# EasyEDA schematic SCH_nfcbusinesscard2_2025-07-16.json
TITLE: Sheet_1; REV: 1.0; Date: 2025-07-11; Sheet: 1/1; Drawn By: jaydenaleung; Company: Your Company
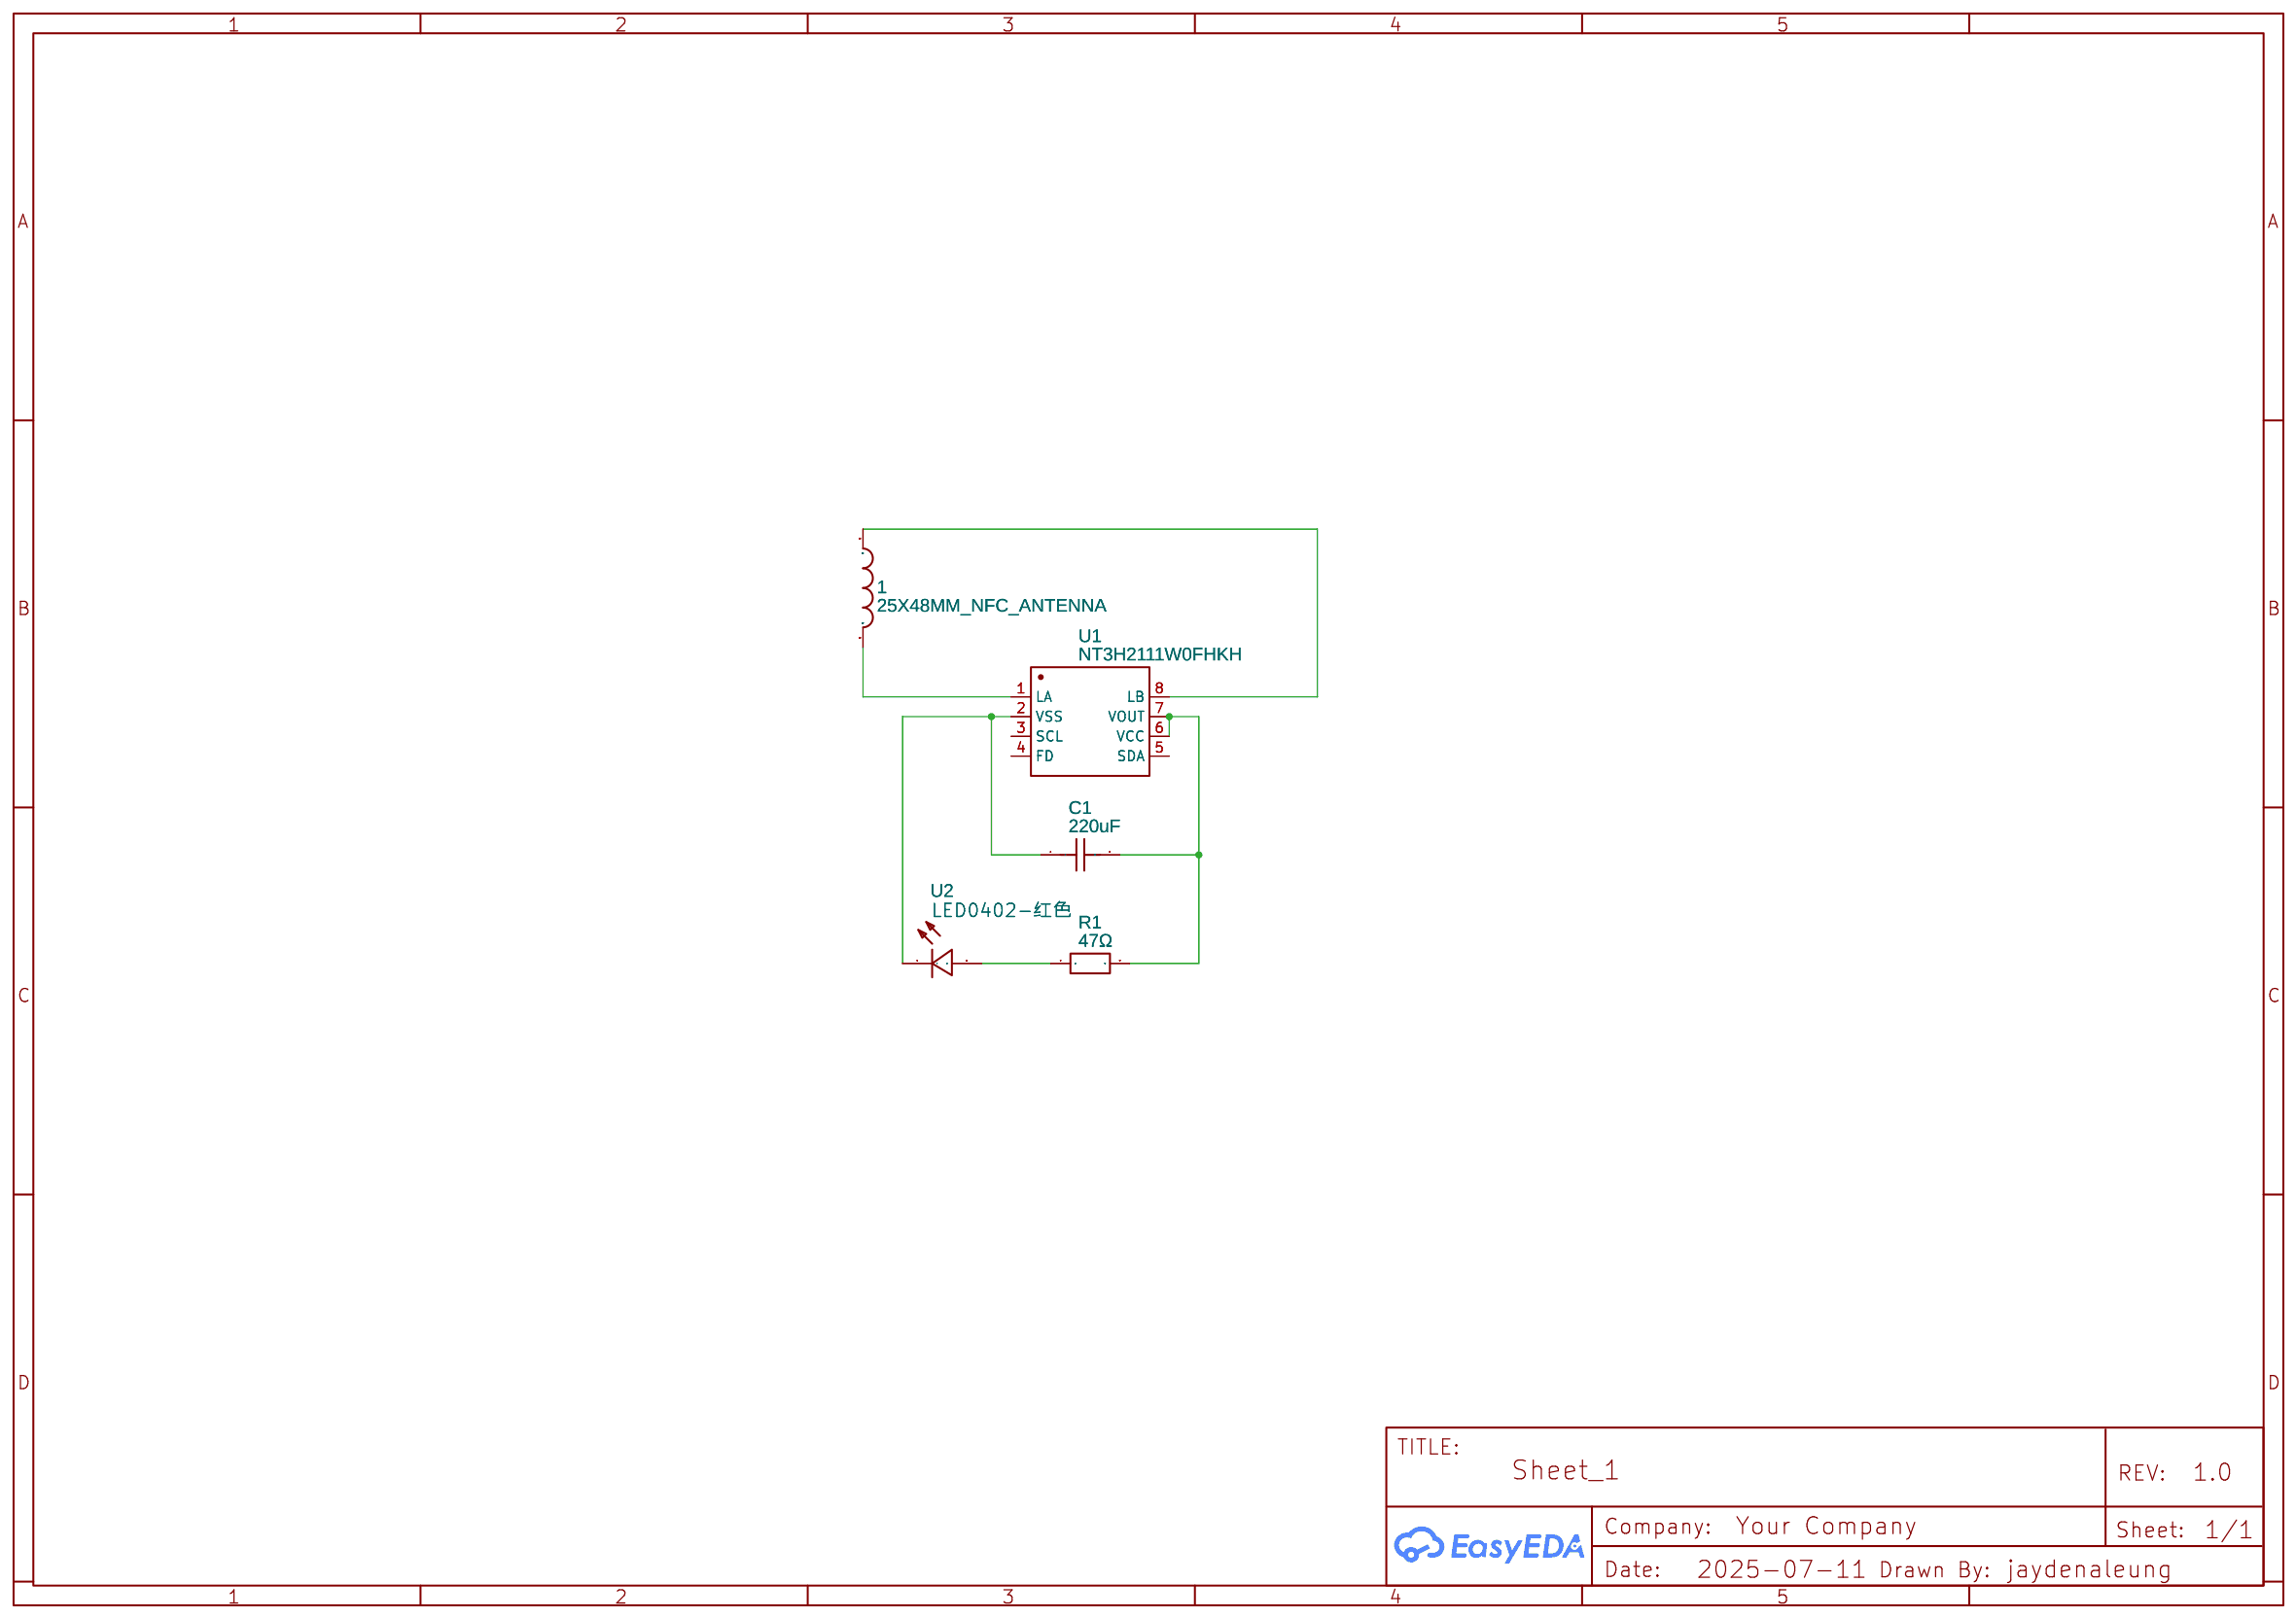
[diagram p0: schematic sheet]

## Parts
1  25X48MM_NFC_ANTENNA  [25X48MM_NFC_ANTENNA]
C1  220uF  [C0603]
R1  47Ω  [R0603]
U1  NT3H2111W0FHKH  [XQFN-8_L1.6-W1.6-P0.50-BL_NT3H2111W0FHKH]
U2  LED0402-红色  [LED0402-RD_RED]

## Library data of the parts
1 = 25X48MM_NFC_ANTENNA: Contributor: dnonoo
C1 = C_0603_US: Contributor: LCEDA_Lib
R1 = R_0603_EU: Contributor: LCEDA_Lib
U1 = NT3H2111W0FHKH: Contributor: LCSC; Supplier: LCSC; Supplier Part: C710403; Manufacturer: NXP(恩智浦); JLCPCB Part Class: Extended Part
U2 = LED0402-红色: Contributor: lcsc; Supplier: LCSC; Supplier Part: C9900023317; Manufacturer: null; JLCPCB Part Class: Extended Part

## Nets
Net-(1-P$1): 1.P$1 U1.8(LB)
Net-(1-P$2): 1.P$2 U1.1(LA)
Net-(C1-1): C1.1 U1.2(VSS) U2.1(-)
Net-(C1-2): C1.2 R1.2 U1.6(VCC) U1.7(VOUT)
Net-(R1-1): R1.1 U2.2(+)

Not connected (* = marked no-connect by the designer): U1 3(SCL) 4(FD) 5(SDA)
